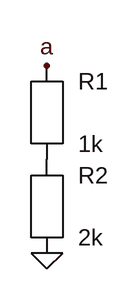
[diagram p0: schematic pin_on_pin.asc]
pin_on_pin.asc, the LTspice schematic file:
Version 4
SHEET 1 880 680
SYMBOL res 96 144 R0
SYMATTR InstName R1
SYMATTR Value 1k
SYMBOL res 96 240 R0
SYMATTR InstName R2
SYMATTR Value 2k
FLAG 96 96 a
FLAG 96 288 0

The netlist it stands for:
* pin_on_pin.asc
R1 a P001 1k
R2 P001 0 2k
.backanno
.end